# EAGLE design µprog-V1.1 (EAGLE 5.10)
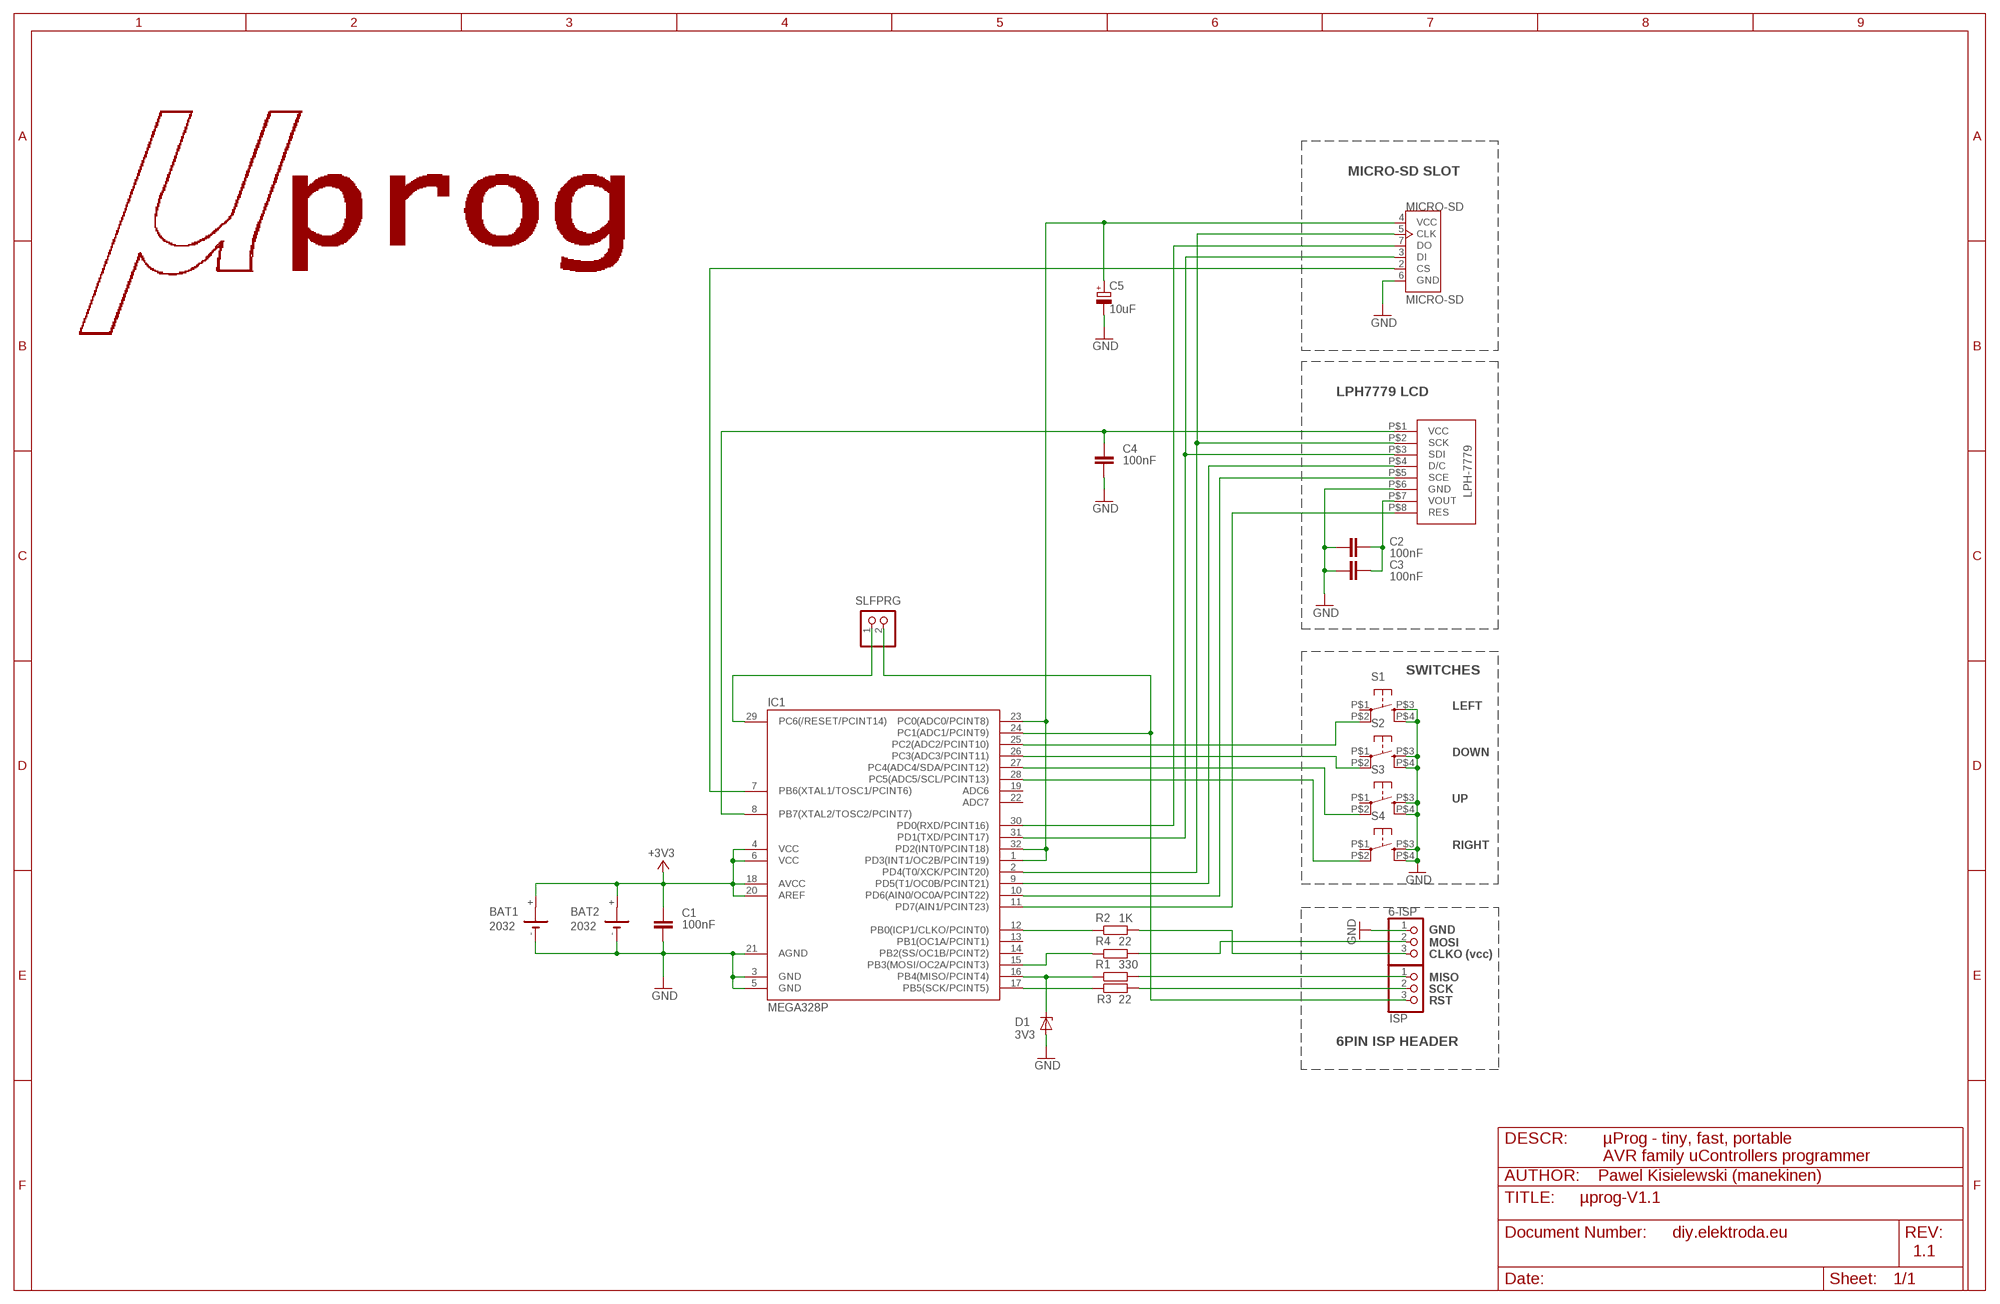
[diagram p0: schematic, sheet 1]

## Parts
6-ISP  PINHD-1X03_2.54-SMD-90°  [1X03SMD/90]
BAT1  2032  [KZH20SMD]
BAT2  2032  [KZH20SMD]
C1  100nF  C-EUC0805  [C0805]
C2  100nF  C-EUC0805  [C0805]
C3  100nF  C-EUC0805  [C0805]
C4  100nF  C-EUC0805  [C0805]
C5  10uF  CPOL-EUC/6032-28R  [C/6032-28R]
D1  3V3  ZENER-DIODESOD80C  [SOD80C]
IC1  MEGA328P  MEGA48/88/168-AU  [TQFP32-08]
ISP  PINHD-1X03_2.54-SMD-90°  [1X03SMD/90]
MICRO-SD  MICRO-SD  SF-MICROSD  [MICROSD]
R1  330  R-EU_R0805  [R0805]
R2  1K  R-EU_R0805  [R0805]
R3  22  R-EU_R0805  [R0805]
R4  22  R-EU_R0805  [R0805]
S1  10-XX-SMD  [B3F-10XX-SMD]
S2  10-XX-SMD  [B3F-10XX-SMD]
S3  10-XX-SMD  [B3F-10XX-SMD]
S4  10-XX-SMD  [B3F-10XX-SMD]
SLFPRG  PINHD-1X02_2.54  [1X02]
U$1  NOKIA3310  [NOKIA]

## Nets
+3V3: BAT1.+ BAT2.+ C1.1 IC1.4(VCC) IC1.6(VCC) IC1.18(AVCC) IC1.20(AREF)
GND: 6-ISP.1 BAT1.- BAT2.- C1.2 C2.2 C3.2 C4.2 C5.- D1.A IC1.3(GND) IC1.5(GND) IC1.21(AGND) MICRO-SD.6(GND) S1.P$3(S) S1.P$4(S1) S2.P$3(S) S2.P$4(S1) S3.P$3(S) S3.P$4(S1) S4.P$3(S) S4.P$4(S1) U$1.P$6(GND)
LCD-RES: IC1.11(PD7(AIN1/PCINT23)) U$1.P$8(RES)
LCD-SCE: IC1.10(PD6(AIN0/OC0A/PCINT22)) U$1.P$5(SCE)
LCD-VCC: C4.1 IC1.8(PB7(XTAL2/TOSC2/PCINT7)) U$1.P$1(VCC)
MISO2: IC1.30(PD0(RXD/PCINT16)) MICRO-SD.7(DO)
MISO_B: ISP.1 R1.2
MOSI: IC1.15(PB3(MOSI/OC2A/PCINT3)) R4.1
MOSI2: IC1.31(PD1(TXD/PCINT17)) MICRO-SD.3(DI) U$1.P$3(SDI)
N$1: 6-ISP.2
N$2: IC1.12(PB0(ICP1/CLKO/PCINT0)) R2.1
N$3: D1.C IC1.16(PB4(MISO/PCINT4)) R1.1
N$4: IC1.9(PD5(T1/OC0B/PCINT21)) U$1.P$4(D/C)
N$18: 6-ISP.3 R2.2
N$22: IC1.28(PC5(ADC5/SCL/PCINT13)) S4.P$2(P1)
N$23: IC1.27(PC4(ADC4/SDA/PCINT12)) S3.P$2(P1)
N$24: IC1.26(PC3(ADC3/PCINT11)) S2.P$2(P1)
N$25: IC1.25(PC2(ADC2/PCINT10)) S1.P$2(P1)
RESET: IC1.29(PC6(/RESET/PCINT14)) SLFPRG.1
RST: IC1.24(PC1(ADC1/PCINT9)) ISP.3 SLFPRG.2
SCK: IC1.17(PB5(SCK/PCINT5)) R3.1
SCK2: IC1.2(PD4(T0/XCK/PCINT20)) MICRO-SD.5(CLK) U$1.P$2(SCK)
SCK_B: ISP.2
SD-CS: IC1.7(PB6(XTAL1/TOSC1/PCINT6)) MICRO-SD.2(CS)
SD-VCC: C5.+ IC1.1(PD3(INT1/OC2B/PCINT19)) IC1.23(PC0(ADC0/PCINT8)) IC1.32(PD2(INT0/PCINT18)) MICRO-SD.4(VCC)
VOUT: C2.1 C3.1 U$1.P$7(VOUT)
Unconnected: IC1.13(PB1(OC1A/PCINT1)) IC1.14(PB2(SS/OC1B/PCINT2)) IC1.19(ADC6) IC1.22(ADC7) R3.2 R4.2 S1.P$1(P) S2.P$1(P) S3.P$1(P) S4.P$1(P)

## Notes on the sheet
- MICRO-SD SLOT
- LPH7779 LCD
- SWITCHES
- LEFT
- DOWN
- UP
- RIGHT
- GND
- MOSI
- CLKO (vcc)
- MISO
- SCK
- RST
- 6PIN ISP HEADER
- DESCR: | µProg - tiny, fast, portable
- AVR family uControllers programmer
- AUTHOR:    Pawel Kisielewski (manekinen)
- diy.elektroda.eu
- 1.1

## Library data of the parts
6-ISP ISP = pinhead-2:PINHD-1X03: PIN HEADER
BAT1 BAT2 = kzh20_lithium_batterie_holder:2032
C1-C4 = rcl:C-EU: CAPACITOR, European symbol
C5 = rcl:CPOL-EU: POLARIZED CAPACITOR, European symbol
D1 = diode:ZENER-DIODE: Z-Diode
IC1 = avr-6:MEGA48/88/168
MICRO-SD = microsd:SF-MICROSD
R1-R4 = rcl:R-EU_: RESISTOR, European symbol
S1-S4 = switch-omron:10-XX-SMD
SLFPRG = pinhead-2:PINHD-1X02: PIN HEADER
U$1 = Nokia3310:NOKIA3310

## Board
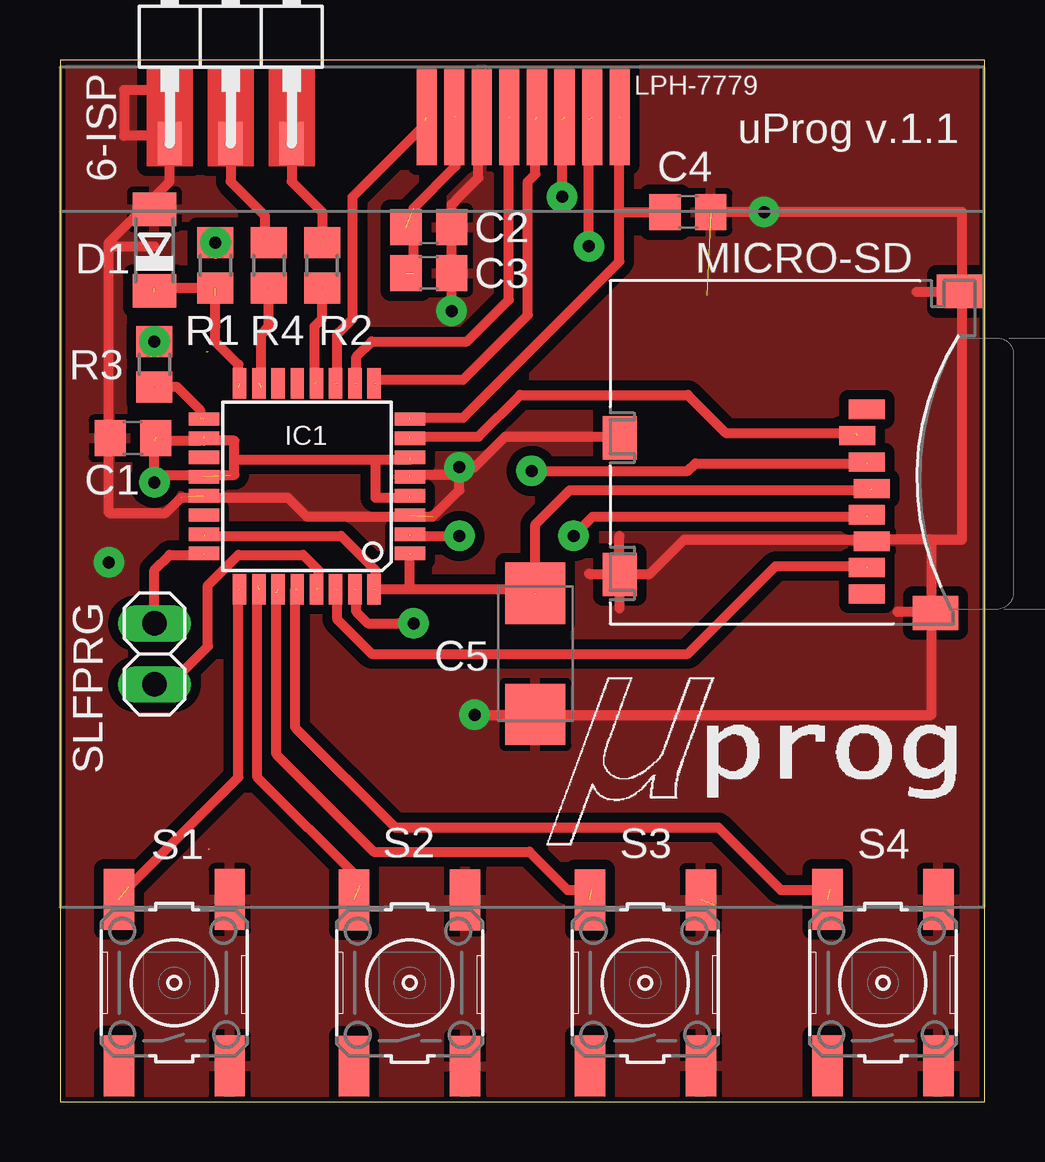
[diagram p1: board, top side]
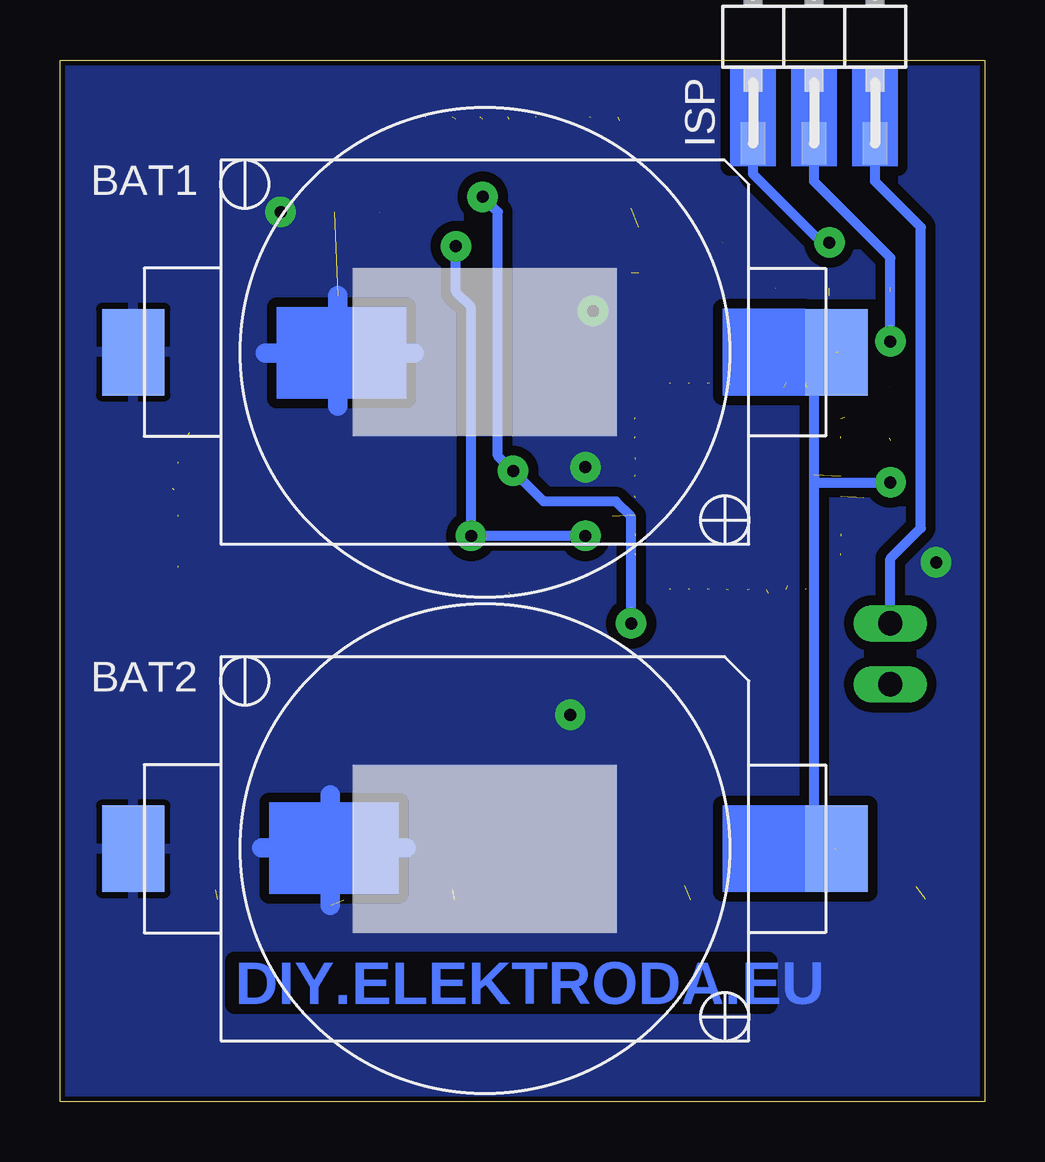
[diagram p2: board, bottom side, seen from below]

Size 38.53 x 43.42 mm. Coordinates in mm from the lower left corner, seen from the top.
Outline: 0,0 38.53,0 38.53,43.42 0,43.42 0,0
Copper layers (1*16): Top 0.035mm / dielectric 1.5mm / Bottom 0.035mm
Design rules "default *": minimum track width 10mil, minimum drill 24mil, track to track 16mil, track to pad 16mil, pad to pad 16mil, via to via 16mil, smd to smd 16mil, copper to edge 8mil, drill to drill 8mil, minimum pad ring 10mil, minimum via ring 8mil, stop-mask expansion 4mil, vias tented up to drill 0mil, thermal gap 10mil

### Footprints (pad centres in the part's own frame; a part is rotated, then mirrored left to right if it is on the bottom)
1X03SMD/90 = smd 1.016 x 1.778: 1 -1.27,-5.08; 2 1.27,-5.08; 3 3.81,-5.08
KZH20SMD = smd 2.6 x 3.6: + 14.65,0; - -14.65,0
C0805 = smd 1.3 x 1.5: 1 -0.95,0; 2 0.95,0
C/6032-28R = smd 2.55 x 2.5: + 2.525,0; - -2.525,0
SOD80C = smd 1.4 x 1.8: A 1.7,0; C -1.7,0
TQFP32-08 = smd 1.27 x 0.559: 1 -4.293,2.8; 2 -4.293,2; 3 -4.293,1.2; 4 -4.293,0.4; 5 -4.293,-0.4; 6 -4.293,-1.2; 7 -4.293,-2; 8 -4.293,-2.8; 17 4.293,-2.8; 18 4.293,-2; 19 4.293,-1.2; 20 4.293,-0.4; 21 4.293,0.4; 22 4.293,1.2; 23 4.293,2; 24 4.293,2.8 | smd 0.559 x 1.27: 9 -2.8,-4.293; 10 -2,-4.293; 11 -1.2,-4.293; 12 -0.4,-4.293; 13 0.4,-4.293; 14 1.2,-4.293; 15 2,-4.293; 16 2.8,-4.293; 25 2.8,4.293; 26 2,4.293; 27 1.2,4.293; 28 0.4,4.293; 29 -0.4,4.293; 30 -1.2,4.293; 31 -2,4.293; 32 -2.8,4.293
MICROSD = smd 0.8 x 1.5: 1 -1.94,2.7; 2 -0.84,2.3; 3 0.26,2.7; 4 1.36,2.9; 5 2.46,2.7; 6 3.56,2.9; 7 4.66,2.7; 8 5.76,2.7 | smd 1.4 x 1.9: NC -6.85,6.55; NC3 6.55,5.55 | smd 1.8 x 1.4: NC1 -0.75,-7.6; NC2 4.95,-7.6
R0805 = smd 1.3 x 1.5: 1 -0.95,0; 2 0.95,0
B3F-10XX-SMD = smd 2.54 x 1.27: P$1 -3.467,2.311; P$2 3.467,2.311; P$3 3.467,-2.311; P$4 -3.467,-2.311
1X02 = drill 1.016 long: 1 -1.27,0; 2 1.27,0
NOKIA = smd 0.838 x 4: P$1 4.026,2.01; P$2 2.874,2.01; P$3 1.718,2.01; P$4 0.57,2.01; P$5 -0.578,2.008; P$6 -1.732,2.008; P$7 -2.881,2.008; P$8 -4.03,2.008

### Placement (x,y rotation side)
6-ISP  5.84,45.02 0 top
BAT1  20.83,31.24 0 bottom
BAT2  20.83,10.54 0 bottom
C1  3.04,27.66 180 top
C2  15.37,36.45 0 top
C3  15.37,34.54 0 top
C4  26.16,37.08 0 top
C5  19.81,18.67 90 top
D1  3.94,35.5 90 top
IC1  10.29,25.65 180 top
ISP  8.38,45.02 0 bottom
MICRO-SD  30.92,26.92 270 top
R1  6.48,34.86 90 top
R2  10.92,34.86 90 top
R3  3.94,30.73 90 top
R4  8.7,34.86 90 top
S1  4.76,4.96 90 top
S2  14.57,4.95 90 top
S3  24.39,4.96 90 top
S4  34.29,4.96 90 top
SLFPRG  3.94,18.67 90 top
U$1  19.3,39.02 0 top

### Tracks (layer width: path | path; a pad name or v marks a point on that pad's centre or on a via)
+3V3  (via drill 0.5 pad 1.27)  (7 unrouted)
  Top 0.406: 7.27,26.77 7.27,26.13 3.94,26.13 v3.94,25.81 3.94,27.56 5.84,27.56 6,27.72 | 7.27,26.77 7.27,27.56 6,27.56 | 7.27,26.77 13.14,26.77 | 13.14,26.77 13.14,25.18 14.57,25.18 | 13.14,26.77 14.57,26.77
  Bottom 0.406: 6.22,10.54 7.11,11.43 7.11,25.02 7.11,26.13 7.11,25.81 | 7.11,25.81 v3.94,25.81 | 7.11,25.81 7.11,30.23 6.1,31.24
GND  (via drill 0.5 pad 1.27)  (5 unrouted)
  Top 0.406: 17.43,42.64 17.43,38.51 16.64,37.72 16.32,37.4 v16.32,32.96 | 6-ISP.1 4.57,38.35 2.03,35.81 2.03,35.66 | 2.03,35.66 2.03,24.54 4.41,24.54 5.05,25.18 9.49,25.18 10.29,24.38 15.53,24.38 16.64,25.5 v16.64,26.45 | 36.32,23.43 34.1,23.43 | v16.64,26.45 16.64,26.13 14.57,26.13 | 2.03,35.66 3.94,35.66 | 6-ISP.1 4.57,40.26 2.67,40.26 2.67,42.16 4.57,42.16 6-ISP.1 | 37.59,33.75 35.69,33.75 | 36.32,20.42 34.89,20.42 | 23.3,22 | 23.3,22 24.57,22 26,23.43 33.78,23.43 | 22.03,22 23.3,22 | 23.3,22 23.3,23.59 | 23.3,22 23.3,20.57 | 19.81,16.13 v17.27,16.13 36.32,16.13 36.32,20.42 | v16.64,26.45 17.27,26.45 18.54,27.72 23.3,27.72 | 36.32,20.42 36.32,23.43 | 37.59,33.75 37.59,23.43 36.32,23.43 | 37.59,33.75 37.59,37.08 v29.34,37.08 C4.2
  Bottom 0.813: 27.27,10.57 27.27,12.8 | 27.27,10.57 27.27,8.19 | 27.27,10.57 30.13,10.57 | 24.1,10.57 27.27,10.57 | 26.96,31.21 26.96,33.59 | 26.96,31.21 26.96,28.99 | 26.96,31.21 29.97,31.21 | 23.78,31.21 26.96,31.21
  other vias: 2.03,22.48
  pour Top: 0,43.43 0,0 38.54,0 38.54,43.43
  pour Bottom: 0,43.43 0,0 38.54,0 38.54,43.43
LCD-RES  (2 unrouted)
  Top 0.406: 11.56,29.94 11.56,32 12.19,32.64 12.19,37.72 15.21,40.74 15.21,40.89
LCD-SCE  (2 unrouted)
  Top 0.406: 12.35,29.94 12.35,31.05 12.99,31.69 16.95,31.69 18.7,33.43 18.7,41.05
LCD-VCC  (3 unrouted)
  Top 0.406: 14.57,28.51 16.8,28.51 23.3,35.02 23.3,37.08 | 23.3,37.08 23.3,41.05 | 23.3,37.08 C4.1
MISO2  (2 unrouted)
  Top 0.406: 11.56,21.37 11.56,20.1 12.99,18.67 26.16,18.67 29.81,22.32 33.62,22.32
MISO_B  (via drill 0.5 pad 1.27)  (1 unrouted)
  Top 0.406: v6.48,35.81 6.48,35.34
  Bottom 0.406: ISP.1 9.65,38.67 6.79,35.81 v6.48,35.81
MOSI  (2 unrouted)
  Top 0.406: R4.1 8.7,32.32 8.38,32 8.38,29.78
MOSI2  (via drill 0.5 pad 1.27)  (4 unrouted)
  Top 0.406: 12.35,21.37 12.35,20.42 12.83,19.94 14.1,19.94 v14.73,19.94 | v19.65,26.29 26.16,26.29 26.48,26.61 33.62,26.61 | v20.92,37.72 20.92,40.96
  Bottom 0.406: v20.92,37.72 20.29,37.08 20.29,26.92 v19.65,26.29 18.38,25.02 15.37,25.02 14.73,24.38 v14.73,19.94
N$1
  Top 0.406: 6-ISP.2 7.11,38.35 8.54,36.93 8.54,35.97
N$2  (2 unrouted)
  Top 0.406: 10.6,29.94 10.6,32.32 10.92,32.64 R2.1
N$3  (4 unrouted)
  Top 0.406: 6.48,32.32 6.48,33.59 | 7.43,29.78 7.43,30.73 6.48,31.69 R1.1 3.94,33.91
N$4  (2 unrouted)
  Top 0.406: 13.14,29.94 13.14,30.1 16.8,30.1 19.49,32.8 19.49,38.35 19.81,38.67 19.81,40.96
N$18  (1 unrouted)
  Top 0.406: 6-ISP.3 | 6-ISP.3 9.65,38.35 10.92,37.08 R2.2
N$22  (2 unrouted)
  Top 0.406: 32.07,8.83 30.04,8.83 27.43,11.43 13.97,11.43 9.81,15.59 9.81,21.37
N$23  (2 unrouted)
  Top 0.406: 22.16,8.83 21.15,8.83 19.56,10.41 13.08,10.41 9.02,14.48 9.02,21.21
N$24  (2 unrouted)
  Top 0.406: 12.51,9.02 12.51,9.24 8.22,13.53 8.22,21.53
N$25  (2 unrouted)
  Top 0.406: 2.86,9.02 2.86,8.95 5.84,11.94 7.43,13.53 7.43,21.37
RESET  (1 unrouted)
  Top 0.406: 10.76,21.37 10.76,22.16 10.13,22.8 7.43,22.8 6.16,21.53 6.16,18.99 4.57,17.4 SLFPRG.1
RST  (1 unrouted)
  Top 0.406: SLFPRG.2 3.94,22.16 4.57,22.8 6,22.8
  Bottom 0.406: ISP.3 4.57,38.35 2.67,36.45 2.67,23.91 3.94,22.64 SLFPRG.2
SCK  (2 unrouted)
  Top 0.406: R3.1 4.89,29.78 5.84,28.83 5.84,28.51
SCK2  (via drill 0.5 pad 1.27)  (4 unrouted)
  Top 0.406: v21.4,23.59 22.19,24.38 33.62,24.38 | v22.03,35.66 22.03,40.96 | v16.64,23.59 16.48,23.59 14.57,23.59
  Bottom 0.406: v22.03,35.66 22.03,33.75 21.4,33.12 v21.4,23.59 v16.64,23.59
SCK_B  (via drill 0.5 pad 1.27)
  Bottom 0.406: ISP.2 7.11,38.35 3.94,35.18 v3.94,31.69
SD-CS  (2 unrouted)
  Top 0.406: 33.15,27.88 27.75,27.88 26.16,29.46 19.18,29.46 17.43,27.72 14.57,27.72
SD-VCC  (5 unrouted)
  Top 0.406: 14.57,21.37 13.14,21.37 13.14,22.16 11.72,23.59 6,23.59 | 14.57,21.37 14.57,22.8 | 14.57,21.37 19.81,21.37 | 33.78,25.5 21.24,25.5 19.81,24.07 19.81,21.37 | 19.81,21.37 19.81,21.21
VOUT  (3 unrouted)
  Top 0.406: 16.48,41.05 16.48,38.99 14.73,37.24 14.73,34.54
(copper drawn outside any net)
  shapes: Bottom area x7, Top area x3

### Text on the board
Bottom: DIY.ELEKTRODA.EU
tPlace: uProg v.1.1
tNames: MICRO-SD